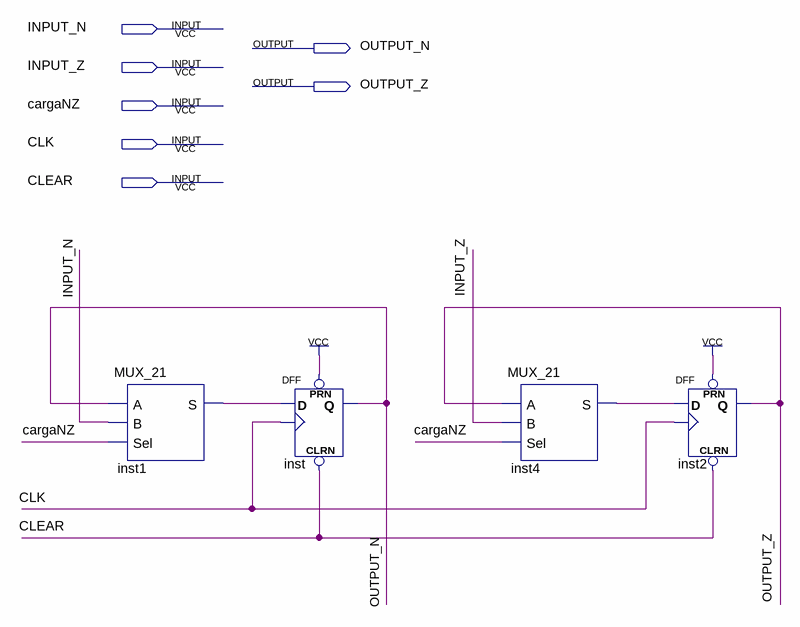
[diagram p0: schematic sheet]
// Quartus schematic NZ.bdf as structural Verilog: 4 symbols, 7 pins
module NZ (
  input  INPUT_N,
  input  INPUT_Z,
  input  cargaNZ,
  input  CLK,
  input  CLEAR,
  output OUTPUT_N,
  output OUTPUT_Z
);

  wire inst1_s, inst4_s;

  MUX_21 inst1 (.A(OUTPUT_N), .B(INPUT_N), .Sel(cargaNZ), .S(inst1_s));
  DFF inst (.CLRN(CLEAR), .CLK(CLK), .D(inst1_s), .PRN(1'b1), .Q(OUTPUT_N));
  MUX_21 inst4 (.A(OUTPUT_Z), .B(INPUT_Z), .Sel(cargaNZ), .S(inst4_s));
  DFF inst2 (.CLRN(CLEAR), .CLK(CLK), .D(inst4_s), .PRN(1'b1), .Q(OUTPUT_Z));
endmodule
